# Altium schematic sheet generic.SchDoc
size A4; Organization: Badgerloop Electrical; Address1: 133 Engineering Research Building; Address2: 1500 Engineering Drive; Address3: Madison, Wi 53706
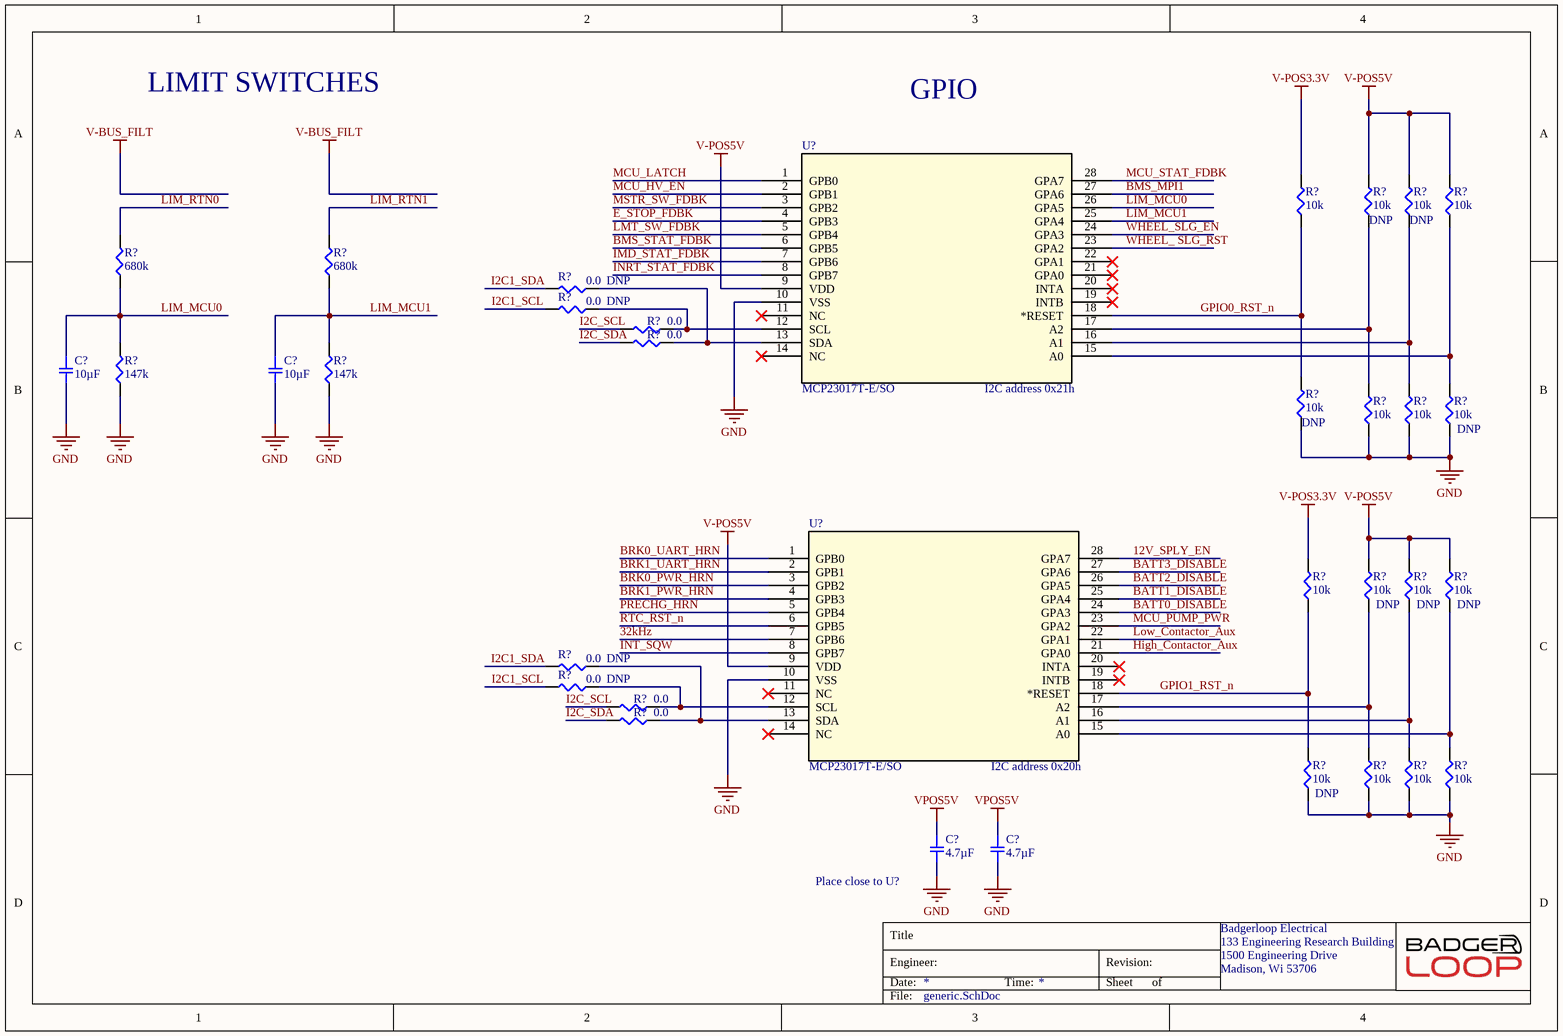
[diagram p0: generic.SchDoc]

## Parts
(Parts that share a designator on the sheet are numbered #1, #2 ... from top to bottom, then left to right.)
C?#1  10µF  [SMD-0805C]
C?#2  10µF  [SMD-0805C]
C?#3  4.7µF  [SMD-0805C]
C?#4  4.7µF  [SMD-0805C]
R?#1  10k  [SMD-0805-RES]
R?#2  10k  [SMD-0805-RES]
R?#3  10k  [SMD-0805-RES]
R?#4  10k  [SMD-0805-RES]
R?#5  680k  [SMD-0402-RES]
R?#6  680k  [SMD-0402-RES]
R?#7  0.0  [SMD-0805-RES]
R?#8  0.0  [SMD-0805-RES]
R?#9  0.0  [SMD-0805-RES]
R?#10  0.0  [SMD-0805-RES]
R?#11  147k  [SMD-0805-RES]
R?#12  147k  [SMD-0805-RES]
R?#13  10k  [SMD-0805-RES]
R?#14  10k  [SMD-0805-RES]
R?#15  10k  [SMD-0805-RES]
R?#16  10k  [SMD-0805-RES]
R?#17  10k  [SMD-0805-RES]
R?#18  10k  [SMD-0805-RES]
R?#19  10k  [SMD-0805-RES]
R?#20  10k  [SMD-0805-RES]
R?#21  0.0  [SMD-0805-RES]
R?#22  0.0  [SMD-0805-RES]
R?#23  0.0  [SMD-0805-RES]
R?#24  0.0  [SMD-0805-RES]
R?#25  10k  [SMD-0805-RES]
R?#26  10k  [SMD-0805-RES]
R?#27  10k  [SMD-0805-RES]
R?#28  10k  [SMD-0805-RES]
U?#1  MCP23017T-E/SO  [SOIC28-W_MC-M]
U?#2  MCP23017T-E/SO  [SOIC28-W_MC-M]

## Nets
GND: C?#1.2 C?#2.2 C?#3.2 C?#4.2 R?#11.1 R?#12.1 R?#13.1 R?#14.1 R?#15.1 R?#16.1 R?#25.1 R?#26.1 R?#27.1 R?#28.1 U?#1.10(VSS) U?#2.10(VSS)
V-POS3.3V: R?#1.2 R?#17.2
V-POS5V: R?#2.2 R?#3.2 R?#4.2 R?#18.2 R?#19.2 R?#20.2 U?#1.9(VDD) U?#2.9(VDD)
VPOS5V: C?#3.1 C?#4.1
12V_SPLY_EN: U?#2.28(GPA7)
32kHz: U?#2.7(GPB6)
BATT0_DISABLE: U?#2.24(GPA3)
BATT1_DISABLE: U?#2.25(GPA4)
BATT2_DISABLE: U?#2.26(GPA5)
BATT3_DISABLE: U?#2.27(GPA6)
BMS_MPI1: U?#1.27(GPA6)
BMS_STAT_FDBK: U?#1.6(GPB5)
BRK0_PWR_HRN: U?#2.3(GPB2)
BRK0_UART_HRN: U?#2.1(GPB0)
BRK1_PWR_HRN: U?#2.4(GPB3)
BRK1_UART_HRN: U?#2.2(GPB1)
E_STOP_FDBK: U?#1.4(GPB3)
GPIO0_RST_n: R?#1.1 R?#13.2 U?#1.18(*RESET)
GPIO1_RST_n: R?#17.1 R?#25.2 U?#2.18(*RESET)
High_Contactor_Aux: U?#2.21(GPA0)
I2C1_SCL: R?#8.2 R?#22.2
I2C1_SDA: R?#7.2 R?#21.2
I2C_SCL: R?#9.2 R?#23.2
I2C_SDA: R?#10.2 R?#24.2
IMD_STAT_FDBK: U?#1.7(GPB6)
INRT_STAT_FDBK: U?#1.8(GPB7)
INT_SQW: U?#2.8(GPB7)
LIM_MCU0: C?#1.1 R?#5.1 R?#11.2 U?#1.26(GPA5)
LIM_MCU1: C?#2.1 R?#6.1 R?#12.2 U?#1.25(GPA4)
LIM_RTN0: R?#5.2
LIM_RTN1: R?#6.2
LMT_SW_FDBK: U?#1.5(GPB4)
Low_Contactor_Aux: U?#2.22(GPA1)
MCU_HV_EN: U?#1.2(GPB1)
MCU_LATCH: U?#1.1(GPB0)
MCU_PUMP_PWR: U?#2.23(GPA2)
MCU_STAT_FDBK: U?#1.28(GPA7)
MSTR_SW_FDBK: U?#1.3(GPB2)
PRECHG_HRN: U?#2.5(GPB4)
RTC_RST_n: U?#2.6(GPB5)
WHEEL_ SLG_RST: U?#1.23(GPA2)
WHEEL_SLG_EN: U?#1.24(GPA3)
NetR?#2_1: R?#2.1 R?#14.2 U?#1.17(A2)
NetR?#3_1: R?#3.1 R?#15.2 U?#1.16(A1)
NetR?#4_1: R?#4.1 R?#16.2 U?#1.15(A0)
NetR?#7_1: R?#7.1 R?#10.1 U?#1.13(SDA)
NetR?#8_1: R?#8.1 R?#9.1 U?#1.12(SCL)
NetR?#18_1: R?#18.1 R?#26.2 U?#2.17(A2)
NetR?#19_1: R?#19.1 R?#27.2 U?#2.16(A1)
NetR?#20_1: R?#20.1 R?#28.2 U?#2.15(A0)
NetR?#21_1: R?#21.1 R?#24.1 U?#2.13(SDA)
NetR?#22_1: R?#22.1 R?#23.1 U?#2.12(SCL)

Not connected (* = marked no-connect by the designer): U?#1 11(NC)* 14(NC)* 19(INTB)* 20(INTA)* 21(GPA0)* 22(GPA1)*; U?#2 11(NC)* 14(NC)* 19(INTB)* 20(INTA)*

## Notes on the sheet
- LIMIT SWITCHES
- GPIO
- (near U?#1) I2C address 0x21h
- (near U?#2) I2C address 0x20h
- (near C?#3) Place close to U?
- Title
- Engineer:
- Date:
- Time:
- Revision:
- Sheet
- of
- File:

## Library data of the parts
C?#1 C?#2 = GRM21BC81E106KE51L: CAP CER 10UF 25V X6S 0805; Manufacturer: Murata Electronics North America; Factory Stock: 0; Unit Price (USD): 0.25; Minimum Quantity: 1; Tolerance: ±10%; Datasheets: http://www.murata.com/~/media/webrenewal/support/library/catalog/products/capacitor/mlcc/c02e.pdf; Image: //media.digikey.com/Renders/Murata%20Renders/0805%20(2012%20Metric)%20.85mm.jpg; Digi-Key Part Number: 490-10502-1-ND; Part Number: GRM21BC81E106KE51L; Quantity Available: 230; @ qty: 0; Packaging: Cut Tape (CT); Series: GRM; Part Status: Active; Value: 10µF; Voltage: 25V; Temperature Coefficient: X6S; Operating Temperature: -55°C ~ 105°C; Features: Derating Recommended; Ratings: -; Applications: General Purpose; Mounting Type: Surface Mount, MLCC; Package / Case: 0805 (2012 Metric); Size / Dimension: 0.079" L x 0.049" W (2.00mm x 1.25mm); Height - Seated (Max): -; Thickness (Max): 0.055" (1.40mm); Lead Spacing: -; Lead Style: -
C?#3 C?#4 = GRM21BR60J475KA11L: CAP CER 4.7UF 6.3V X5R 0805; Manufacturer: Murata Electronics North America; Factory Stock: 0; Unit Price (USD): 0.28; Minimum Quantity: 1; Tolerance: ±10%; Datasheets: http://www.murata.com/~/media/webrenewal/support/library/catalog/products/capacitor/mlcc/c02e.pdf; Image: //media.digikey.com/Renders/Murata%20Renders/0805%20(2012%20Metric)%20.85mm.jpg; Digi-Key Part Number: 490-9749-1-ND; Part Number: GRM21BR60J475KA11L; Quantity Available: 2821; @ qty: 0; Packaging: Cut Tape (CT); Series: GRM; Part Status: Active; Value: 4.7µF; Voltage: 6.3V; Temperature Coefficient: X5R; Operating Temperature: -55°C ~ 85°C; Features: -; Ratings: -; Applications: General Purpose; Mounting Type: Surface Mount, MLCC; Package / Case: 0805 (2012 Metric); Size / Dimension: 0.079" L x 0.049" W (2.00mm x 1.25mm); Height - Seated (Max): -; Thickness (Max): 0.055" (1.40mm); Lead Spacing: -; Lead Style: -
R?#1-R?#4 R?#13-R?#20 R?#25-R?#28 = ERJ-P06J103V: RES SMD 10K OHM 5% 1/2W 0805; Manufacturer: Panasonic Electronic Components; Factory Stock: 0; Unit Price (USD): 0.01839; @ qty: 1500; Minimum Quantity: 1; Power (Watts): 0.5W, 1/2W; Temperature Coefficient: ±200ppm/°C; Part Number: ERJ-P06J103V; Datasheets: https://industrial.panasonic.com/cdbs/www-data/pdf/RDA0000/AOA0000C243.pdf; Image: //media.digikey.com/Renders/Panasonic%20Renders/ERJ-0805%20Pkg.jpg; Digi-Key Part Number: P10KADCT-ND; Quantity Available: 413576; Packaging: Cut Tape (CT); Series: ERJ; Part Status: Active; Value: 10k; Tolerance: ±5%; Composition: Thick Film; Features: Automotive AEC-Q200, Pulse Withstanding; Operating Temperature: -55°C ~ 155°C; Package / Case: 0805 (2012 Metric); Supplier Device Package: 0805; Size / Dimension: 0.079" L x 0.049" W (2.00mm x 1.25mm); Height - Seated (Max): 0.028" (0.70mm); Number of Terminations: 2; Failure Rate: -
  R?#2 R?#3 R?#13 R?#16 R?#18-R?#20 R?#25: DNP: DNP
R?#5 R?#6 = ERJ-2GEJ684X: RES SMD 680K OHM 5% 1/10W 0402; Manufacturer: Panasonic Electronic Components; Factory Stock: 0; Unit Price (USD): 0.00350; @ qty: 1500; Minimum Quantity: 1; Power (Watts): 0.1W, 1/10W; Temperature Coefficient: ±200ppm/°C; Part Number: ERJ-2GEJ684X; Datasheets: http://industrial.panasonic.com/www-cgi/jvcr13pz.cgi?E+PZ+3+AOA0001+ERJ2GEJ684X+7+WW; Image: //media.digikey.com/Photos/Panasonic%20Photos/ERJ-PA2-Series.jpg; Digi-Key Part Number: P680KJCT-ND; Quantity Available: 77606; Packaging: Cut Tape (CT); Series: ERJ; Part Status: Active; Value: 680k; Tolerance: ±5%; Composition: Thick Film; Features: Automotive AEC-Q200; Operating Temperature: -55°C ~ 155°C; Package / Case: 0402 (1005 Metric); Supplier Device Package: 0402; Size / Dimension: 0.039" L x 0.020" W (1.00mm x 0.50mm); Height - Seated (Max): 0.016" (0.40mm); Number of Terminations: 2; Failure Rate: -
R?#7-R?#10 R?#21-R?#24 = ERJ-6GEY0R00V: RES SMD 0.0 OHM JUMPER 1/8W 0805; Manufacturer: Panasonic Electronic Components; Factory Stock: 0; Unit Price (USD): 0.00544; @ qty: 1500; Minimum Quantity: 1; Power (Watts): 0.125W, 1/8W; Part Number: ERJ-6GEY0R00V; Datasheets: http://industrial.panasonic.com/www-cgi/jvcr13pz.cgi?E+PZ+3+AOA0001+ERJ6GEY0R00V+7+WW; Image: //media.digikey.com/Renders/Panasonic%20Renders/ERJ-0805%20Pkg.jpg; Digi-Key Part Number: P0.0ACT-ND; Quantity Available: 1597627; Packaging: Cut Tape (CT); Series: ERJ; Part Status: Active; Value: 0.0; Tolerance: Jumper; Composition: Thick Film; Features: Automotive AEC-Q200; Temperature Coefficient: -; Operating Temperature: -55°C ~ 155°C; Package / Case: 0805 (2012 Metric); Supplier Device Package: 0805; Size / Dimension: 0.079" L x 0.049" W (2.00mm x 1.25mm); Height - Seated (Max): 0.028" (0.70mm); Number of Terminations: 2; Failure Rate: -
  R?#7 R?#8 R?#21 R?#22: DNP: DNP
R?#11 R?#12 = ERJ-6ENF1473V: RES SMD 147K OHM 1% 1/8W 0805; Manufacturer: Panasonic Electronic Components; Factory Stock: 0; Unit Price (USD): 0.00729; @ qty: 1500; Minimum Quantity: 1; Power (Watts): 0.125W, 1/8W; Temperature Coefficient: ±100ppm/°C; Part Number: ERJ-6ENF1473V; Datasheets: http://industrial.panasonic.com/www-cgi/jvcr13pz.cgi?E+PZ+3+AOA0002+ERJ6ENF1473V+7+WW; Image: //media.digikey.com/Renders/Panasonic%20Renders/ERJ-0805%20Pkg.jpg; Digi-Key Part Number: P147KCCT-ND; Quantity Available: 10283; Packaging: Cut Tape (CT); Series: ERJ; Part Status: Active; Value: 147k; Tolerance: ±1%; Composition: Thick Film; Features: Automotive AEC-Q200; Operating Temperature: -55°C ~ 155°C; Package / Case: 0805 (2012 Metric); Supplier Device Package: 0805; Size / Dimension: 0.079" L x 0.049" W (2.00mm x 1.25mm); Height - Seated (Max): 0.028" (0.70mm); Number of Terminations: 2; Failure Rate: -
U?#1 U?#2 = MCP23017T-E/SO: IC I/O EXPANDER I2C 16B 28SOIC; Manufacturer: Microchip; Manufacturer P/N: MCP23017T-E/SO; Digikey P/N: MCP23017T-E/SOCT-ND; Digikey Link: https://www.digikey.com/product-detail/en/microchip-technology/MCP23017T-E-SO/MCP23017T-E-SOCT-ND/5358289